# Altium project Esp-Nextion.PrjPCB
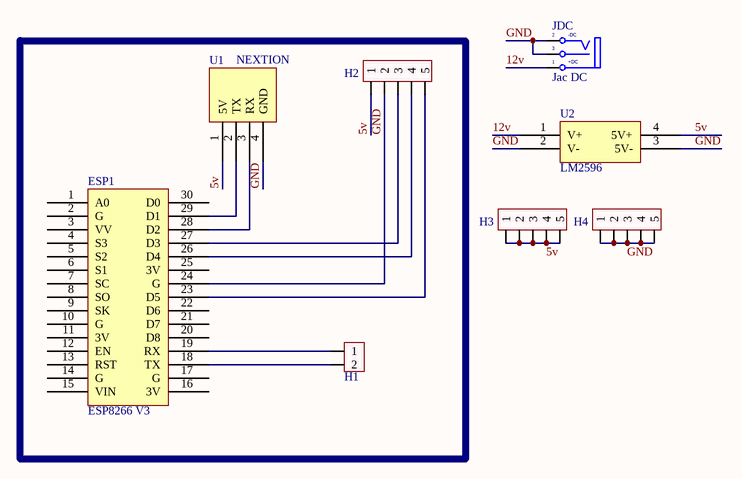
[diagram p0: Esp-Nextion.SchDoc]
1 sheet, 8 parts. Net scope: global (net labels, ports and power ports of the same name join across sheets).
Board files: Esp-Nextion.PcbDoc, PCB1.PcbDoc

## Sheet Esp-Nextion.SchDoc
size A3

### Parts
ESP1  ESP8266 V3  [ESP8266 V3]
H1  Header2  [HDR2]  (value not drawn)
H2  Header5  [Header5]  (value not drawn)
H3  Header5  [Header5]  (value not drawn)
H4  Header5  [Header5]  (value not drawn)
JDC  Jac DC  [DC-IN]
U1  NEXTION  [NEXTION]
U2  LM2596  [LM2596]

### Nets
5v: H2.1 H3.1 H3.2 H3.3 H3.4 H3.5 U1.1(5V) U2.4(5V+)
12v: JDC.1(T) U2.1(V+)
GND: ESP1.24(G) H2.2 H4.1 H4.2 H4.3 H4.4 H4.5 JDC.2(TN) JDC.3(S) U1.4(GND) U2.2(V-) U2.3(5V-)
NetESP1_18: ESP1.18(TX) H1.2
NetESP1_19: ESP1.19(RX) H1.1
NetESP1_23: ESP1.23(D5) H2.5
NetESP1_26: ESP1.26(D4) H2.4
NetESP1_27: ESP1.27(D3) H2.3
NetESP1_28: ESP1.28(D2) U1.3(RX)
NetESP1_29: ESP1.29(D1) U1.2(TX)

Not connected (* = marked no-connect by the designer): ESP1 1(A0) 2(G) 3(VV) 4(S3) 5(S2) 6(S1) 7(SC) 8(SO) 9(SK) 10(G) 11(3V) 12(EN) 13(RST) 14(G) 15(VIN) 16(3V) 17(G) 20(D8) 21(D7) 22(D6) 25(3V) 30(D0)

### Notes on the sheet
- (in symbol DCIN) -DC; +DC

### Library data of the parts
ESP1 = ESP8266 V3: ESP8266
H1 = Header2: Header IDC, 2 x 1 Pin Vertical 2.54mm Pitch (Non-Boxed, Male)
H2-H4 = Header5: Header IDC, 5 x 1 Pin Vertical 2.54mm Pitch (Non-Boxed, Male)
JDC = DCIN: Jac DC input; Value: Jac DC